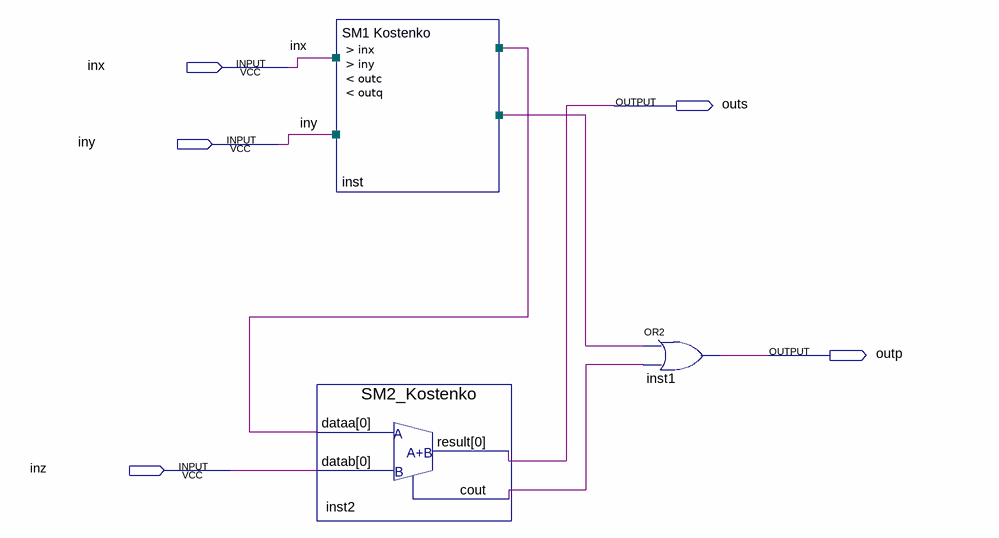
[diagram p0: schematic sheet]
// Quartus schematic CL2_Project_Kostenko_v1.bdf as structural Verilog: 3 symbols, 5 pins
module CL2_Project_Kostenko_v1 (
  input  inx,
  input  iny,
  input  inz,
  output outs,
  output outp
);

  wire inst2_cout, undriven, undriven_2;

  \SM1_Kostenko  inst (.inx(inx), .iny(iny));  // open: outc, outq
  SM2_Kostenko inst2 (.dataa(undriven), .datab(inz), .result(outs), .cout(inst2_cout));
  or inst1 (outp, undriven_2, inst2_cout);
endmodule
